# Altium schematic sheet node24-ethernet.SchDoc: Ethernet
size Tabloid; Author: Emergence Team; Engineer: asheem; Organization: Emergence; Address1: Oakland, California; Address2: a@aliengeometry.com; Address3: Black Rock City '18; Address4: OPEN SOURCE H/W; DocumentNumber: 6; Revision: Rev 0.1; SheetNumber: 6; SheetTotal: 6; Project: NODE24
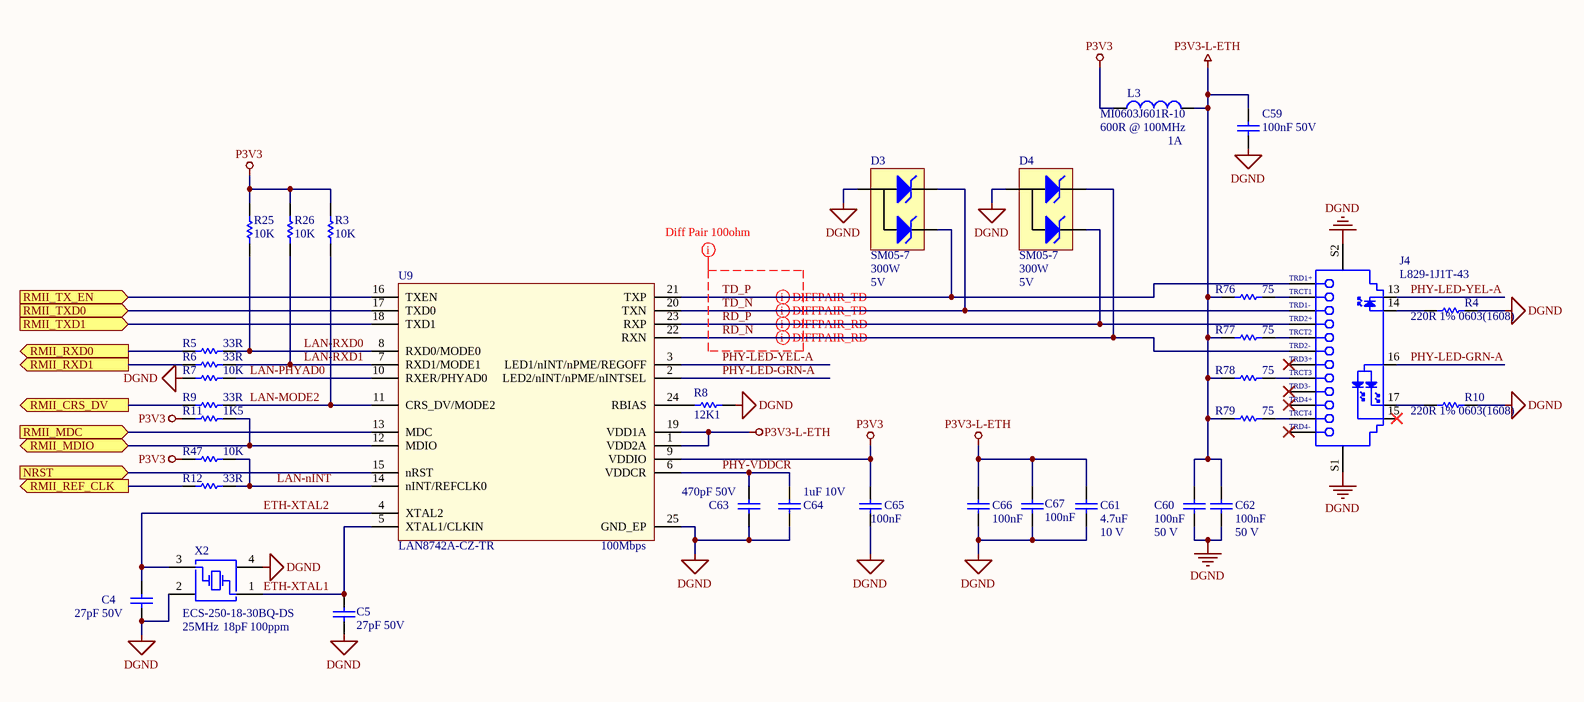
[diagram p0: node24-ethernet.SchDoc]

## Parts
C4  27pF 50V  [CAPC0603(1608)100_L]
C5  27pF 50V  [CAPC0603(1608)100_L]
C59  100nF 50V  [CAPC0603(1608)100_L]
C60  value 100nF  Rated Voltage: 50 V  [CAPC0603(1608)100_L]  (hidden comment: 100nF 50V)
C61  value 4.7uF  Rated Voltage: 10 V  [CAPC0603(1608)100_L]  (hidden comment: 4.7uF 10V)
C62  value 100nF  Rated Voltage: 50 V  [CAPC0603(1608)100_L]  (hidden comment: 100nF 50V)
C63  470pF 50V  [CAPC0603(1608)100_L]
C64  1uF 10V  [CAPC0603(1608)100_L]
C65  100nF  [CAPC0603(1608)100_L]
C66  100nF  [CAPC0603(1608)100_L]
C67  100nF  [CAPC0603(1608)100_L]
D3  Manufacturer Part Number: SM05-7  Max Power Dissipation: 300W  Reverse Standoff Voltage: 5V  [SOT-23]  (hidden comment: TVS_5V_DUAL_SOT23-3_SM05-7)
D4  Manufacturer Part Number: SM05-7  Max Power Dissipation: 300W  Reverse Standoff Voltage: 5V  [SOT-23]  (hidden comment: TVS_5V_DUAL_SOT23-3_SM05-7)
J4  L829-1J1T-43  [BELS-L829-1J1T-43_V]
L3  Manufacturer Part Number: MI0603J601R-10  Max DC Current: 1A  Impedance: 600R @ 100MHz  [0603L]  (hidden comment: BEAD_LAIRD_MI0603J601R-10)
R3  10K  [RESC0603(1608)_L]
R4  220R 1% 0603(1608)  [RESC0603(1608)_L]
R5  33R  [RESC0603(1608)_L]
R6  33R  [RESC0603(1608)_L]
R7  10K  [RESC0603(1608)_L]
R8  12K1  [RESC0603(1608)_L]
R9  33R  [RESC0603(1608)_L]
R10  220R 1% 0603(1608)  [RESC0603(1608)_L]
R11  1K5  [RESC0603(1608)_L]
R12  33R  [RESC0603(1608)_L]
R25  10K  [RESC0603(1608)_L]
R26  10K  [RESC0603(1608)_L]
R47  10K  [RESC0603(1608)_L]
R76  value 75  [RESC0603(1608)_M]  (hidden comment: 75R 1% 0603(1608))
R77  value 75  [RESC0603(1608)_M]  (hidden comment: 75R 1% 0603(1608))
R78  value 75  [RESC0603(1608)_M]  (hidden comment: 75R 1% 0603(1608))
R79  value 75  [RESC0603(1608)_M]  (hidden comment: 75R 1% 0603(1608))
U9  Data Rate: 100Mbps  [QFN24_B4X4_P0MM5_EP]  (hidden comment: LAN8742A-CZ-TR)
X2  Load Capacitance: 18pF  Frequency Stability: 100ppm  Frequency: 25MHz  Manufacturer Part Number: ECS-250-18-30BQ-DS  [XTAL_4SMD_5x3mm2]  (hidden comment: XTAL_25MHz_18PF_4SMD_100PPM_AUTOMOTIVE_ECS-250-18-30BQ-DS)

## Ports
NRST (in), RMII_CRS_DV (out), RMII_MDC (in), RMII_MDIO (bidir), RMII_REF_CLK (out), RMII_RXD0 (out), RMII_RXD1 (out), RMII_TX_EN (in), RMII_TXD0 (in), RMII_TXD1 (in)

## Nets
DGND: C4.2 C5.2 C59.1 C60.1 C61.2 C62.1 C63.1 C64.1 C65.1 C66.1 C67.1 D3.3(A) D4.3(A) J4.S1 J4.S2 R4.1 R7.2 R8.2 R10.1 U9.25(GND_EP) X2.2(CAN) X2.4(CAN)
P3V3: C65.2 L3.1 R3.2 R11.1 R25.2 R26.2 R47.2 U9.9(VDDIO)
P3V3-L-ETH: C59.2 C60.2 C61.1 C62.2 C66.2 C67.2 L3.2 R76.1 R77.1 R78.1 R79.1 U9.1(VDD2A) U9.19(VDD1A)
ETH-XTAL1: C5.1 U9.5(XTAL1/CLKIN) X2.1(OSC1)
ETH-XTAL2: C4.1 U9.4(XTAL2) X2.3
LAN-MODE2: R3.1 R9.2 U9.11(CRS_DV/MODE2)
LAN-nINT: R12.2 R47.1 U9.14(nINT/REFCLK0)
LAN-PHYAD0: R7.1 U9.10(RXER/PHYAD0)
LAN-RXD0: R5.2 R25.1 U9.8(RXD0/MODE0)
LAN-RXD1: R6.2 R26.1 U9.7(RXD1/MODE1)
NRST: U9.15(nRST) ; port NRST
PHY-LED-GRN-A: J4.16 U9.2(LED2/nINT/nPME/nINTSEL)
PHY-LED-YEL-A: J4.13 U9.3(LED1/nINT/nPME/REGOFF)
PHY-VDDCR: C63.2 C64.2 U9.6(VDDCR)
RD_N: D4.1(K1) J4.6(TRD2-) U9.22(RXN)
RD_P: D4.2(K2) J4.4(TRD2+) U9.23(RXP)
RMII_CRS_DV: R9.1 ; port RMII_CRS_DV
RMII_MDC: U9.13(MDC) ; port RMII_MDC
RMII_MDIO: R11.2 U9.12(MDIO) ; port RMII_MDIO
RMII_REF_CLK: R12.1 ; port RMII_REF_CLK
RMII_RXD0: R5.1 ; port RMII_RXD0
RMII_RXD1: R6.1 ; port RMII_RXD1
RMII_TX_EN: U9.16(TXEN) ; port RMII_TX_EN
RMII_TXD0: U9.17(TXD0) ; port RMII_TXD0
RMII_TXD1: U9.18(TXD1) ; port RMII_TXD1
TD_N: D3.1(K1) J4.3(TRD1-) U9.20(TXN)
TD_P: D3.2(K2) J4.1(TRD1+) U9.21(TXP)
NetJ4_2: J4.2(TRCT1) R76.2
NetJ4_5: J4.5(TRCT2) R77.2
NetJ4_8: J4.8(TRCT3) R78.2
NetJ4_11: J4.11(TRCT4) R79.2
NetJ4_14: J4.14 R4.2
NetJ4_17: J4.17 R10.2
NetR8_1: R8.1 U9.24(RBIAS)

Not connected (* = marked no-connect by the designer): J4 7(TRD3+)* 9(TRD3-)* 10(TRD4+)* 12(TRD4-)* 15*

## Layout directives
differential pair: RD_N, RD_P, TD_N, TD_P
rule Matched Net Lengths [Tolerance = 100mil]: RD_N, RD_P, TD_N, TD_P

## Notes on the sheet
- Title
- Size
- Date:
- Tabloid
- Number
- Engineer:
- Revision
- Sheet
- of
- File:
- SVN:

## Library data of the parts
C4 C5 = CMP-1035-00888-1: CAP 27pF 50V ±5% 0603 (1608 Metric) Thickness 1mm SMD; Case-Metric: 1608; Case-EIA: 0603; Tolerance: Â±5%; Technology: SMT; Value: 27pF; Rated Voltage: 50 V; Max Thickness: 1 mm
C59 C60 C62 C65-C67 = CMP-1035-02593-1: CAP 100nF 50V ±20% 0603 (1608 Metric) Thickness 1mm SMD; Tolerance: Â±20%; Case-EIA: 0603; Case-Metric: 1608; Max Thickness: 1 mm; Technology: SMT
  C59 C65-C67: Value: 100nF; Rated Voltage: 50 V
C61 = CMP-1035-02787-1: CAP 4.7uF 10V ±20% 0603 (1608 Metric) Thickness 1mm SMD; Case-EIA: 0603; Case-Metric: 1608; Tolerance: Â±20%; Max Thickness: 1 mm; Technology: SMT
C63 = CMP-1035-01677-1: CAP 470pF 50V ±20% 0603 (1608 Metric) Thickness 1mm SMD; Case-Metric: 1608; Tolerance: Â±20%; Case-EIA: 0603; Technology: SMT; Value: 470pF; Max Thickness: 1 mm; Rated Voltage: 50 V
C64 = CMP-1035-02734-1: CAP 1uF 10V ±20% 0603 (1608 Metric) Thickness 1mm SMD; Tolerance: Â±20%; Case-EIA: 0603; Case-Metric: 1608; Technology: SMT; Value: 1uF; Max Thickness: 1 mm; Rated Voltage: 10 V
D3 D4 = TVS_5V_DUAL_SOT23-3_SM05-7: TVS DIODE 5VWM 20.6VC SOT23; Manufacturer: Diodes; Direction: Unidirectional,Bidirectional; Element Configuration: Common Anode; Capacitance: 230pF; Number of Unidirectional Channels: 2; Clamping Voltage: 20.6V; Power Line Protection: No; Polarity: Unidirectional; Breakdown Voltage: 7.3V; Leakage Current: 10uA; ESD Protection: Yes; Test Current: 1mA; Peak Pulse Current: 17A; Min Breakdown Voltage: 6.2V; Supplier 1: Digi-Key; Stock 1: 20844; Pricing 1: 1=0.46, 10=0.341, 100=0.1932, 500=0.12792, 1000=0.09808 (USD); Mount: Surface Mount; Case/Package: SOT-23; Number of Pins: 3; Contact Plating: Tin,Matte; Min Operating Temperature: -55°C; Max Operating Temperature: 150°C; Package Quantity: 3000; Packaging: Tape and Reel; Peak Pulse Power: 300W; Termination: SMD/SMT; Working Voltage: 5V; Max Reverse Leakage Current: 10uA; Length: 2.9mm; Height: 1mm; Width: 1.3mm; Depth: 1.3mm; Radiation Hardening: No; Lead Free: Lead Free; ComponentLink1URL: https://datasheet.ciiva.com/333/ds31828-333314.pdf; ComponentLink1Description: https://datasheet.ciiva.com/333/ds31828-333314.pdf; ComponentLink2URL: https://datasheet.ciiva.com/15186/getdatasheetpartid-375729-15186470.pdf; ComponentLink2Description: https://datasheet.ciiva.com/15186/getdatasheetpartid-375729-15186470.pdf; ComponentLink3URL: https://datasheet.ciiva.com/25956/ds31828-25956699.pdf; ComponentLink3Description: https://datasheet.ciiva.com/25956/ds31828-25956699.pdf; ComponentLink4URL: https://datasheet.ciiva.com/13083/ds31828-89171-13083151.pdf; ComponentLink4Description: https://datasheet.ciiva.com/13083/ds31828-89171-13083151.pdf; Supplier Part Number 1: SM05-7DIDKR-ND
J4 = CMP-1715-00001-1: Gigabit MagJack(R) Ultra Low Profile, 10/100/1000 Base-T, 19-Pin THD, RoHS, Tray; Width: 24.13 mm; RoHSCompliant: True; PartNumber: L829-1J1T-43; Case/Package: Metal; Mount: Through Hole; ComponentLink1Description: Manufacturer URL; Height: 11.3 mm; Package Quantity: 60; Packaging: Tray; Length: 17.78 mm; PackageDescription: 19-Pin Through Hole Device, Body 23.94 x 17.58 mm, Pitch 2.03 mm; ComponentLink2URL: http://belfuse.com/pdfs/L829-1J1T-43.pdf; ComponentLink1URL: http://belfuse.com/ethernet/; Mounting Technology: Through Hole; DatasheetVersion: Rev. G; Pins: 8; ComponentLink2Description: Datasheet
L3 = BEAD_LAIRD_MI0603J601R-10: FERRITE BEAD 600 OHM 0603; Manufacturer: Laird; Number of Lines: 1; DC Resistance (DCR): 200mR; Test Frequency: 100MHz; Supplier 1: Digi-Key; Stock 1: 1193128; Pricing 1: 1=0.18, 10=0.148, 25=0.1152, 50=0.0952, 100=0.0822, 250=0.06572, 500=0.05914, 1000=0.04929 (USD); Mount: Surface Mount; Case/Package: 0603; Weight: 0.002oz; Case Code (Metric): 1608; Case Code (Imperial): 0603; Contact Plating: Tin,Matte; Core Material: Ferrite; Material: Ferrite; Min Operating Temperature: -40°C; Max Operating Temperature: 125°C; Packaging: Tape and Reel; Package Quantity: 1; Max Current Rating: 1A; Termination: SMD/SMT; Frequency: 100MHz; Current Rating: 1A; Length: 1.6mm; Height: 0.8mm; Width: 0.031inch; Depth: 0.8mm; Lead Free: Lead Free; REACH SVHC: Unknown; ComponentLink1URL: https://datasheet.ciiva.com/3082/mi0603j601r-10-a2-vp-3082208.pdf; ComponentLink1Description: https://datasheet.ciiva.com/3082/mi0603j601r-10-a2-vp-3082208.pdf; ComponentLink2URL: https://datasheet.ciiva.com/22650/1685984-22650402.pdf; ComponentLink2Description: https://datasheet.ciiva.com/22650/1685984-22650402.pdf; ComponentLink3URL: https://datasheet.ciiva.com/1013/mi0603j601r-10-1013257.pdf; ComponentLink3Description: https://datasheet.ciiva.com/1013/mi0603j601r-10-1013257.pdf; Supplier Part Number 1: 240-2371-6-ND
R3 R7 R25 R26 R47 = CMP-1012-00623-1: 10K 0.1W 1% 0603 (1608 Metric)  SMD; Value: 10000.00 Ohm; Case-EIA: 0603; Case-Metric: 1608; Power: 0.1 W; Tolerance: 1 %; Technology: SMT
R4 R10 = CMP-1012-00433-1: 220R 0.1W 1% 0603 (1608 Metric)  SMD; Value: 220.00 Ohm; Case-EIA: 0603; Case-Metric: 1608; Technology: SMT; Tolerance: 1 %; Power: 0.1 W
R5 R6 R9 R12 = CMP-1012-00341-1: 33R 0.1W 1% 0603 (1608 Metric)  SMD; Value: 33.00 Ohm; Case-EIA: 0603; Case-Metric: 1608; Tolerance: 1 %; Technology: SMT; Power: 0.1 W
R8 = CMP-1012-00632-1: 12K1 0.1W 1% 0603 (1608 Metric)  SMD; Case-Metric: 1608; Case-EIA: 0603; Value: 12100.00 Ohm; Power: 0.1 W; Technology: SMT; Tolerance: 1 %
R11 = CMP-1012-00528-1: 1K5 0.1W 1% 0603 (1608 Metric)  SMD; Case-EIA: 0603; Value: 1500.00 Ohm; Case-Metric: 1608; Power: 0.1 W; Technology: SMT; Tolerance: 1 %
R76-R79 = CMP-1012-00383-1: 75R 0.1W 1% 0603 (1608 Metric)  SMD; Case-EIA: 0603; Case-Metric: 1608; Power: 0.1 W; Technology: SMT; Tolerance: 1 %
U9 = IC_INTERFACE_ETHERNET_PHY_LAN8742A-CZ-TR: LAN8742A-CZ-TR - Small Footprint RMII 10/100 Ethernet, Transceiver with HP Auto-MDIX and flexPWR Technology SQFN-24; Manufacturer: Microchip; Max Supply Voltage: 3.3V; Min Supply Voltage: 1.8V; Number of Transceivers: 1; Supplier 1: Digi-Key; Stock 1: 3390; Pricing 1: 1=1.24, 25=1.03 (USD); Mount: Surface Mount; Case/Package: QFN; Number of Pins: 24; Min Operating Temperature: 0°C; Max Operating Temperature: 85°C; Package Quantity: 5000; Packaging: Tape and Reel; Radiation Hardening: No; ComponentLink1URL: https://datasheet.ciiva.com/29882/8742a-29882620.pdf; ComponentLink1Description: https://datasheet.ciiva.com/29882/8742a-29882620.pdf; Supplier Part Number 1: LAN8742A-CZ-CT-ND; Manufacturer Part Number: LAN8742A-CZ-TR
X2 = XTAL_25MHz_18PF_4SMD_100PPM_AUTOMOTIVE_ECS-250-18-30BQ-DS: Crystals 25.000MHz 18pF 100ppm -40 to 125C; Manufacturer: ECS International; ESR (Equivalent Series Resistance): 30R; Frequency Tolerance: 30ppm; Supplier 1: Digi-Key; Stock 1: 1363; Pricing 1: 1=1.2, 10=1.063, 50=0.9934, 100=0.8778, 500=0.8316 (USD); Mount: Surface Mount; Case/Package: SMD/SMT; Min Operating Temperature: -40°C; Max Operating Temperature: 125°C; Packaging: Tape and Reel; Package Quantity: 1000; Termination: SMD/SMT; Tolerance: 30ppm; Length: 0.197inch; Height: 0.033inch; Width: 3.2mm; ComponentLink1URL: https://datasheet.ciiva.com/18649/ecx-53bq-18649724.pdf; ComponentLink1Description: https://datasheet.ciiva.com/18649/ecx-53bq-18649724.pdf; ComponentLink2URL: https://datasheet.ciiva.com/18649/ecx-53bq-18649725.pdf; ComponentLink2Description: https://datasheet.ciiva.com/18649/ecx-53bq-18649725.pdf; ComponentLink3URL: https://datasheet.ciiva.com/18649/ecx-53bq-18649726.pdf; ComponentLink3Description: https://datasheet.ciiva.com/18649/ecx-53bq-18649726.pdf; Supplier Part Number 1: XC2003CT-ND